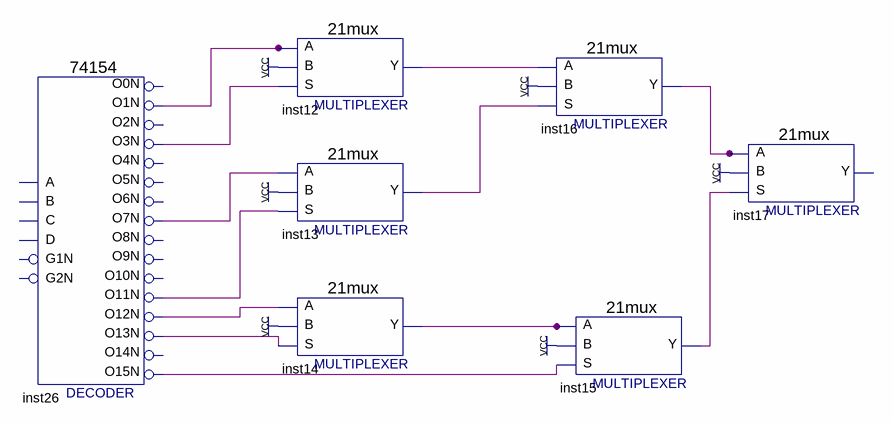
[diagram p0: schematic sheet]
// Quartus schematic lab3_g8_p5_2.bdf as structural Verilog: 7 symbols, 0 pins
module lab3_g8_p5_2 (
);

  wire inst12_y, inst13_y, inst14_y, inst15_y, inst16_y, inst26_o1n, inst26_o3n, inst26_o7n, inst26_o11n,
       inst26_o12n, inst26_o13n, inst26_o15n;

  \74154  inst26 (
    .O12N(inst26_o12n), .O15N(inst26_o15n), .O11N(inst26_o11n), .O1N(inst26_o1n), .O13N(inst26_o13n),
    .O3N(inst26_o3n), .O7N(inst26_o7n));  // open: C, D, B, A, G1N, G2N, O0N, O10N, O14N, O4N, O2N, O6N, O5N, O9N, O8N
  \21mux  inst12 (.S(inst26_o3n), .B(1'b1), .A(inst26_o1n), .Y(inst12_y));
  \21mux  inst13 (.S(inst26_o11n), .B(1'b1), .A(inst26_o7n), .Y(inst13_y));
  \21mux  inst14 (.S(inst26_o13n), .B(1'b1), .A(inst26_o12n), .Y(inst14_y));
  \21mux  inst16 (.S(inst13_y), .B(1'b1), .A(inst12_y), .Y(inst16_y));
  \21mux  inst15 (.S(inst26_o15n), .B(1'b1), .A(inst14_y), .Y(inst15_y));
  \21mux  inst17 (.S(inst15_y), .B(1'b1), .A(inst16_y));  // open: Y
endmodule
